# Altium schematic sheet SPI_LVDS.SchDoc
size A4; Author: T. Kreppel; CompanyName: Universidad de Santiago de Chile; Organization: USACH DIE; Address1: Avenida Ecuador Nº 3519; Address2: Estación Central, Santiago; Address3: Chile; SheetNumber: 4; SheetTotal: 5
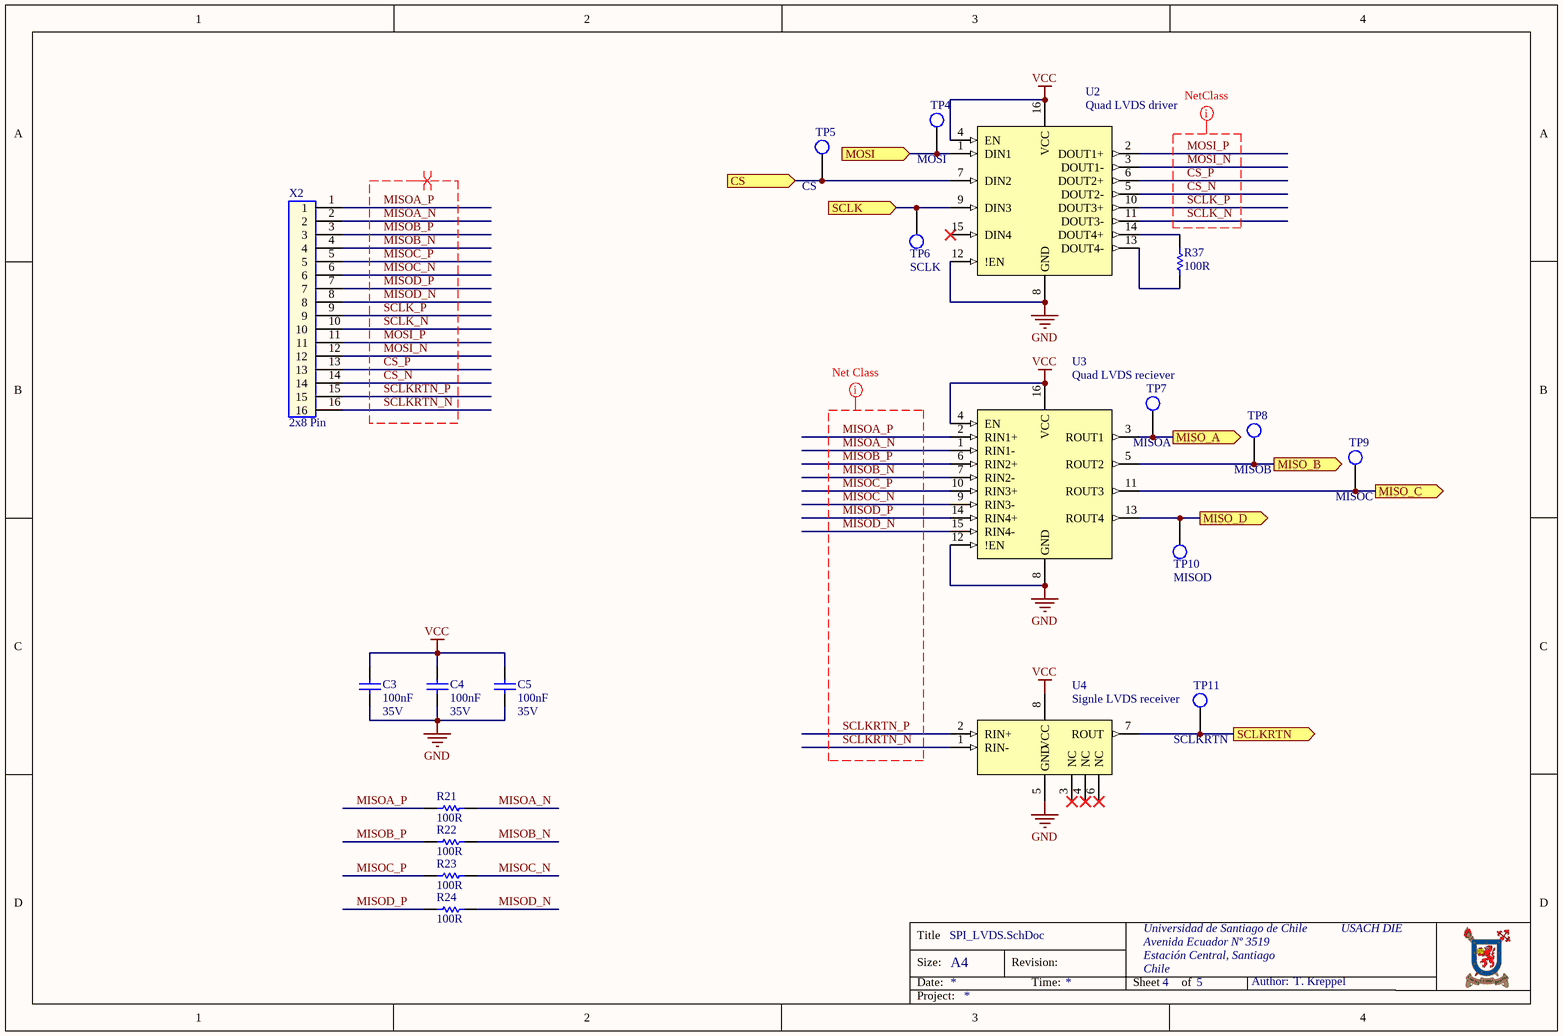
[diagram p0: SPI_LVDS.SchDoc]

## Parts
C3  100nF  Voltage: 35V  [CAP_0603]
C4  100nF  Voltage: 35V  [CAP_0603]
C5  100nF  Voltage: 35V  [CAP_0603]
R21  100R  [RES_0603]
R22  100R  [RES_0603]
R23  100R  [RES_0603]
R24  100R  [RES_0603]
R37  100R  [RES_0603]
TP4  MOSI  [TP_1.6mm]  (no BOM)
TP5  CS  [TP_1.6mm]  (no BOM)
TP6  SCLK  [TP_1.6mm]  (no BOM)
TP7  MISOA  [TP_1.6mm]  (no BOM)
TP8  MISOB  [TP_1.6mm]  (no BOM)
TP9  MISOC  [TP_1.6mm]  (no BOM)
TP10  MISOD  [TP_1.6mm]  (no BOM)
TP11  SCLKRTN  [TP_1.6mm]  (no BOM)
U2  Quad LVDS driver  [TSOP65P640X120-16N]
U3  Quad LVDS reciever  [TSOP65P640X120-16N]
U4  Signle LVDS receiver  [SOIC127P600X170_HS-9N_no_THP]
X2  2x8 Pin  [EHF-108-01-F-D]

## Ports
CS (in), MISO_A (out), MISO_B (out), MISO_C (out), MISO_D (out), MOSI (in), SCLK (in), SCLKRTN (out)

## Nets
GND: C3.2 C4.2 C5.2 U2.8(GND) U2.12(!EN) U3.8(GND) U3.12(!EN) U4.5(GND)
VCC: C3.1 C4.1 C5.1 U2.4(EN) U2.16(VCC) U3.4(EN) U3.16(VCC) U4.8(VCC)
CS: TP5.1 U2.7(DIN2) ; port CS
CS_N: U2.5(DOUT2-) X2.14
CS_P: U2.6(DOUT2+) X2.13
MISO_A: TP7.1 U3.3(ROUT1) ; port MISO_A
MISO_B: TP8.1 U3.5(ROUT2) ; port MISO_B
MISO_C: TP9.1 U3.11(ROUT3) ; port MISO_C
MISO_D: TP10.1 U3.13(ROUT4) ; port MISO_D
MISOA_N: R21.1 U3.1(RIN1-) X2.2
MISOA_P: R21.2 U3.2(RIN1+) X2.1
MISOB_N: R22.1 U3.7(RIN2-) X2.4
MISOB_P: R22.2 U3.6(RIN2+) X2.3
MISOC_N: R23.1 U3.9(RIN3-) X2.6
MISOC_P: R23.2 U3.10(RIN3+) X2.5
MISOD_N: R24.1 U3.15(RIN4-) X2.8
MISOD_P: R24.2 U3.14(RIN4+) X2.7
MOSI: TP4.1 U2.1(DIN1) ; port MOSI
MOSI_N: U2.3(DOUT1-) X2.12
MOSI_P: U2.2(DOUT1+) X2.11
SCLK: TP6.1 U2.9(DIN3) ; port SCLK
SCLK_N: U2.11(DOUT3-) X2.10
SCLK_P: U2.10(DOUT3+) X2.9
SCLKRTN: TP11.1 U4.7(ROUT) ; port SCLKRTN
SCLKRTN_N: U4.1(RIN-) X2.16
SCLKRTN_P: U4.2(RIN+) X2.15
NetR37_1: R37.1 U2.14(DOUT4+)
NetR37_2: R37.2 U2.13(DOUT4-)

Not connected (* = marked no-connect by the designer): U2 15(DIN4)*; U4 3(NC)* 4(NC)* 6(NC)*

## Layout directives
differential pair: CS_N, CS_P, MISOA_N, MISOA_P, MISOB_N, MISOB_P, MISOC_N, MISOC_P, MISOD_N, MISOD_P, MOSI_N, MOSI_P, SCLK_N, SCLK_P, SCLKRTN_N, SCLKRTN_P
net class Match_Rtrn: MISOA_N, MISOA_P, MISOB_N, MISOB_P, MISOC_N, MISOC_P, MISOD_N, MISOD_P, SCLKRTN_N, SCLKRTN_P
net class Match: CS_N, CS_P, MOSI_N, MOSI_P, SCLK_N, SCLK_P

## Notes on the sheet
- Title
- Size:
- Date:
- A4
- Revision:
- Time:
- Sheet
- of
- Author:
- Project:

## Library data of the parts
C3-C5 = Cap_0603: Capacitor; MPN: C0603C104M5RACTU; Rule: PcbType=ProtelPcb; MF: KEMET; Tolerance: 10%; Dielectricum: X7R; Published: 8-Jun-2000; LatestRevisionDate: 17-Jul-2002; LatestRevisionNote: Re-released for DXP Platform.; PackageReference: RAD-0.3; Publisher: Altium Limited; Value: 100nF; Supplier 1: Digikey; Supplier Part Number 1: 399-7845-1-ND; Package: 0603; LCSC Part Number: C14663
R21-R24 R37 = Res0603: Tolerance: 1%; Published: 8-Jun-2000; LatestRevisionDate: 17-Jul-2002; LatestRevisionNote: Re-released for DXP Platform.; PackageReference: AXIAL-0.3; Publisher: Altium Limited; PackageDescription: Axial Device, Thru-Hole; 2 Leads; 0.3 in Pin Spacing; Value: 100R; Supplier 1: Digikey; Supplier Part Number 1: 311-100HRCT-ND; Package: 0603; LCSC Part Number: C22775
TP4-TP11 = TP: 1.6mm Test Point Keystone; MPN: 5006; MF: Keystone Electronics; Created: 2020_04_Kreppel; Supplier 1: Digikey; Supplier Part Number 1: 36-5006-ND
U2 = ADN4665: 3V, LVDS, Quad, CMOS Differential Line Driver; MPN: ADN4665ARUZ; MF: Analog Devices; Created: 2020_05_Kreppel; Supplier 1: Digikey; Supplier Part Number 1: ADN4665ARUZ-ND; LCSC Part Number: C658627
U3 = ADN4666: 3V, LVDS, quad, CMOS Differential Line Receiver; MPN: ADN4666ARUZ; MF: Analog Devices; Created: 2020_05_Kreppel; Supplier 1: Digikey; Supplier Part Number 1: ADN4666ARUZ-ND; LCSC Part Number: C658631
U4 = ADN4662: Single, 3V, CMOS, LVDS High Speed Differential Receiver; MPN: ADN4662BRZ; MF: Analog Devices; Created: 2020_05_Kreppel; Supplier 1: Digikey; Supplier Part Number 1: ADN4662BRZ-ND; LCSC Part Number: C658624
X2 = EHF-108-01-F-D: Dual Row, 2x8 Shrouded IDC Header with Ejectors 50 mil pitch; MF: Samtec; Created: 2020_05_Kreppel; MPN: EHF-108-01-F-D; Supplier 1: Digikey; Supplier Part Number 1: SAM9265-ND; LCSC Part Number: C17569033